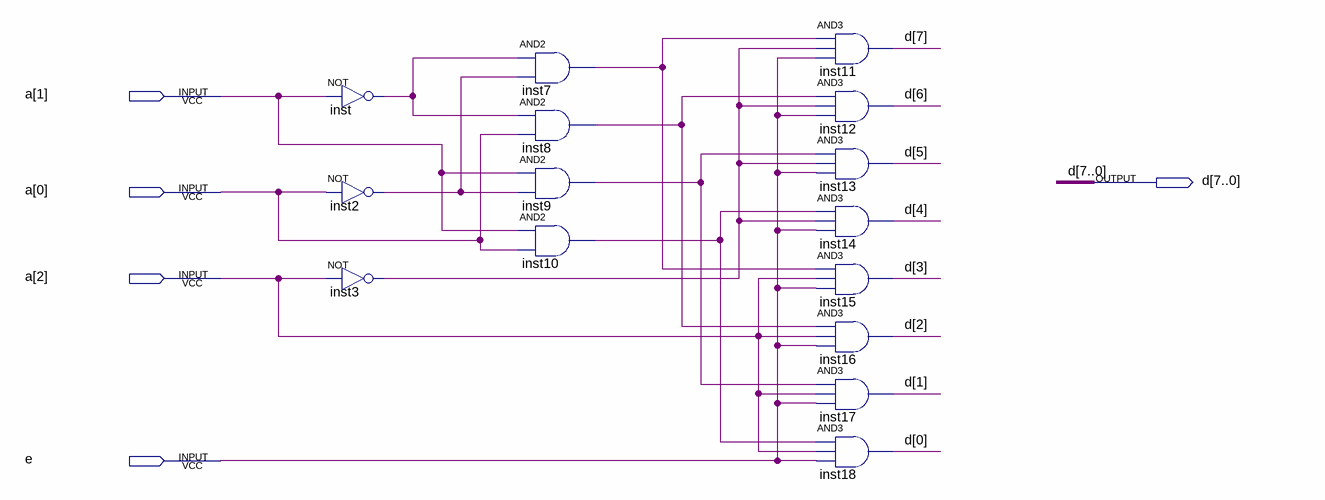
[diagram p0: schematic sheet]
// Quartus schematic mydecoder3_8_2.bdf as structural Verilog: 15 symbols, 5 pins
module mydecoder3_8_2 (
  input  [2:0] a,
  input  e,
  output [7:0] d
);

  wire inst2_out, inst3_out, inst7_out, inst8_out, inst9_out, inst10_out, inst_out;

  not inst (inst_out, a[1]);
  not inst2 (inst2_out, a[0]);
  not inst3 (inst3_out, a[2]);
  and inst7 (inst7_out, inst_out, inst2_out);
  and inst8 (inst8_out, inst_out, a[0]);
  and inst9 (inst9_out, a[1], inst2_out);
  and inst10 (inst10_out, a[1], a[0]);
  and inst11 (d[7], inst7_out, inst3_out, e);
  and inst12 (d[6], inst8_out, inst3_out, e);
  and inst13 (d[5], inst9_out, inst3_out, e);
  and inst14 (d[4], inst10_out, inst3_out, e);
  and inst15 (d[3], inst7_out, a[2], e);
  and inst16 (d[2], inst8_out, a[2], e);
  and inst17 (d[1], inst9_out, a[2], e);
  and inst18 (d[0], inst10_out, a[2], e);
endmodule
